# Altium schematic sheet Sheet1.SchDoc
size A
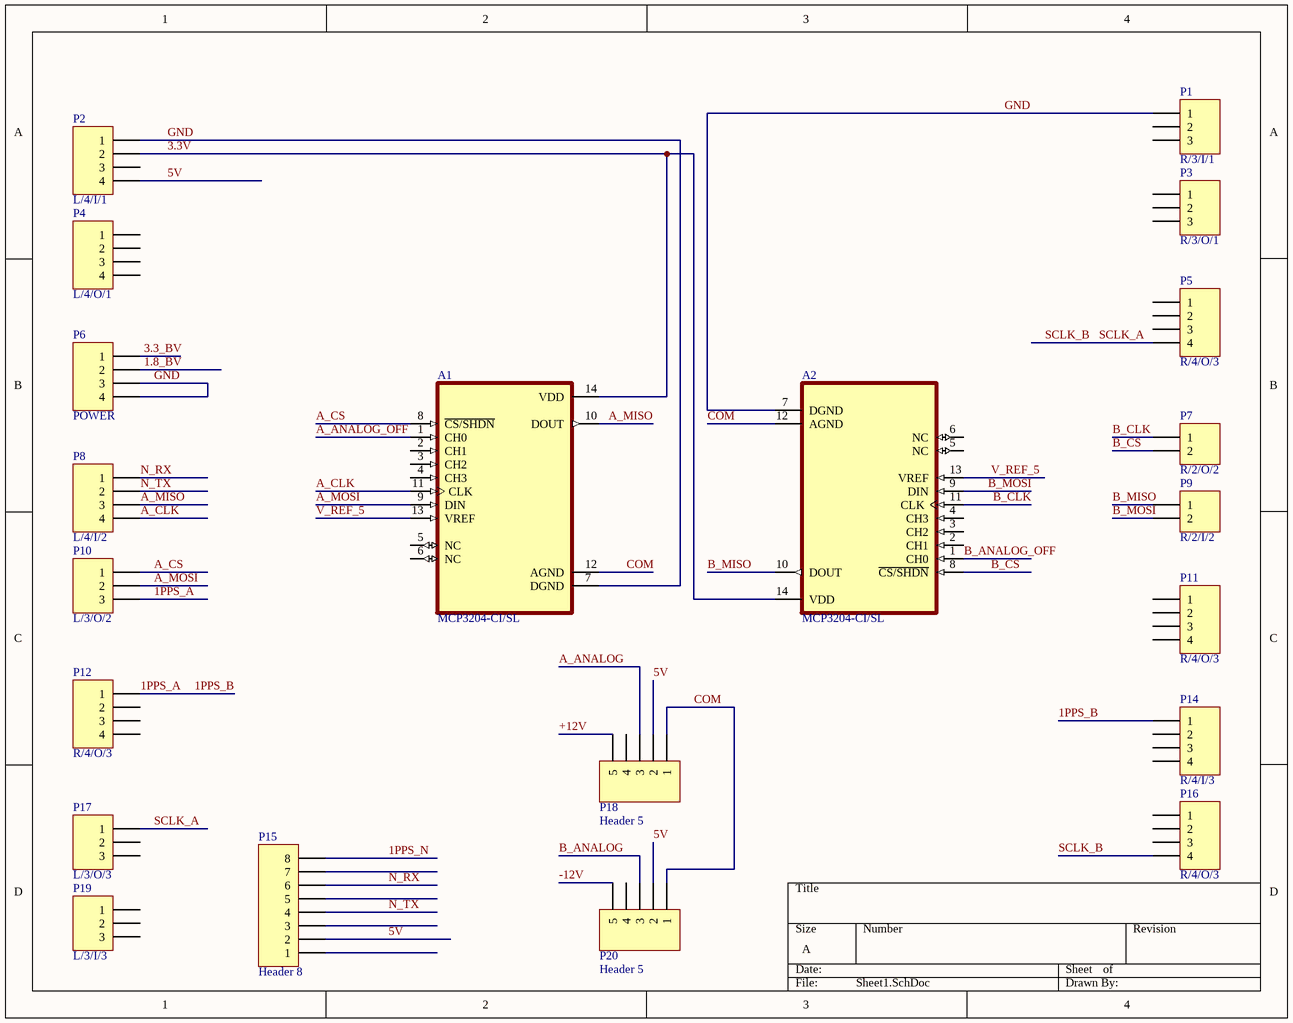
[diagram p0: Sheet1.SchDoc]

## Parts
A1  MCP3204-CI/SL  [SOIC127P600X175-14N]
A2  MCP3204-CI/SL  [SOIC127P600X175-14N]
P1  R/3/I/1  [HDR1X3]
P2  L/4/I/1  [HDR1X4]
P3  R/3/O/1  [HDR1X3]
P4  L/4/O/1  [HDR1X4]
P5  R/4/O/3  [HDR1X4]
P6  POWER  [HDR1X4]
P7  R/2/O/2  [HDR1X2]
P8  L/4/I/2  [HDR1X4]
P9  R/2/I/2  [HDR1X2]
P10  L/3/O/2  [HDR1X3]
P11  R/4/O/3  [HDR1X4]
P12  R/4/O/3  [HDR1X4]
P14  R/4/I/3  [HDR1X4]
P15  Header 8  [HDR1X8]
P16  R/4/O/3  [HDR1X4]
P17  L/3/O/3  [HDR1X3]
P18  Header 5  [HDR1X5]
P19  L/3/I/3  [HDR1X3]
P20  Header 5  [HDR1X5]

## Nets
1.8_BV: P6.2
1PPS_A: P10.3 P12.1 P14.1  [also labelled 1PPS_B]
1PPS_N: P15.8
3.3_BV: P6.1
3.3V: A1.14(VDD) A2.14(VDD) P2.2
5V: P2.4 P15.2 P18.2 P20.2
+12V: P18.5
-12V: P20.5
A_ANALOG: P18.3
A_ANALOG_OFF: A1.1(CH0)
A_CLK: A1.11(CLK) P8.4
A_CS: A1.8(~{CS/SHDN}) P10.1
A_MISO: A1.10(DOUT) P8.3
A_MOSI: A1.9(DIN) P10.2
B_ANALOG: P20.3
B_ANALOG_OFF: A2.1(CH0)
B_CLK: A2.11(CLK) P7.1
B_CS: A2.8(~{CS/SHDN}) P7.2
B_MISO: A2.10(DOUT) P9.1
B_MOSI: A2.9(DIN) P9.2
COM: A1.12(AGND) A2.12(AGND) P18.1 P20.1
GND: A1.7(DGND) A2.7(DGND) P1.1 P2.1 P6.3 P6.4
N_RX: P8.1 P15.6
N_TX: P8.2 P15.4
SCLK_A: P5.4 P16.4 P17.1  [also labelled SCLK_B]
V_REF_5: A1.13(VREF) A2.13(VREF)

Not connected (* = marked no-connect by the designer): A1 2(CH1) 3(CH2) 4(CH3) 5(NC) 6(NC); A2 2(CH1) 3(CH2) 4(CH3) 5(NC) 6(NC); P1 2 3; P2 3; P3 1 2 3; P4 1 2 3 4; P5 1 2 3; P11 1 2 3 4; P12 2 3 4; P14 2 3 4; P15 1 3 5 7; P16 1 2 3; P17 2 3; P18 4; P19 1 2 3; P20 4

## Library data of the parts
A1 A2 = MCP3204-CI/SL: 12 Bit Analog to Digital Converter 2, 4 Input 1 SAR 14-SOIC; MF: Microchip; Check_prices: https://www.snapeda.com/parts/MCP3204-CI/SL/Microchip/view-part/?ref=eda; Value: *; Availability: In Stock; MP: MCP3204-CI/SL; Price: None; Package: SOIC-14 Microchip; SnapEDA_Link: https://www.snapeda.com/parts/MCP3204-CI/SL/Microchip/view-part/?ref=snap; Purchase-URL: https://pricing.snapeda.com/search/part/MCP3204-CI/SL/?ref=eda
P1 P3 P10 P17 P19 = Header 3: Header, 3-Pin; LatestRevisionDate: 17-Jul-2002; LatestRevisionNote: Re-released for DXP Platform.; Publisher: Altium Limited
P2 P4-P6 P8 P11 P12 P14 P16 = Header 4: Header, 4-Pin; LatestRevisionDate: 17-Jul-2002; LatestRevisionNote: Re-released for DXP Platform.; Publisher: Altium Limited
P7 P9 = Header 2: Header, 2-Pin; LatestRevisionDate: 17-Jul-2002; LatestRevisionNote: Re-released for DXP Platform.; Publisher: Altium Limited
P15 = Header 8: Header, 8-Pin; LatestRevisionDate: 17-Jul-2002; LatestRevisionNote: Re-released for DXP Platform.; Publisher: Altium Limited
P18 P20 = Header 5: Header, 5-Pin; LatestRevisionDate: 17-Jul-2002; LatestRevisionNote: Re-released for DXP Platform.; Publisher: Altium Limited